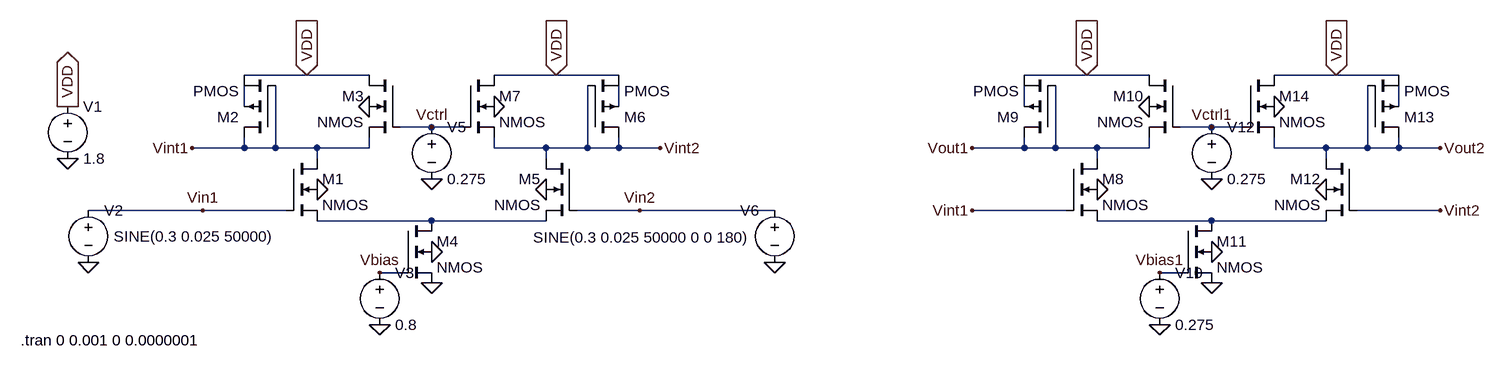
[diagram p0: schematic Cascaded_Differential_VGA.asc]
Cascaded_Differential_VGA.asc, the LTspice schematic file:
Version 4
SHEET 1 1636 680
WIRE -320 -96 -416 -96
WIRE -224 -96 -320 -96
WIRE 64 -96 -32 -96
WIRE 160 -96 64 -96
WIRE 880 -96 784 -96
WIRE 976 -96 880 -96
WIRE 1264 -96 1168 -96
WIRE 1360 -96 1264 -96
WIRE -416 -48 -416 -80
WIRE 160 -48 160 -80
WIRE 784 -48 784 -80
WIRE 1360 -48 1360 -80
WIRE -128 -16 -176 -16
WIRE -80 -16 -128 -16
WIRE 1072 -16 1024 -16
WIRE 1120 -16 1072 -16
WIRE -416 16 -416 0
WIRE -416 16 -496 16
WIRE -368 16 -368 -80
WIRE -368 16 -416 16
WIRE -304 16 -368 16
WIRE -224 16 -224 0
WIRE -224 16 -304 16
WIRE -32 16 -32 0
WIRE 48 16 -32 16
WIRE 112 16 112 -80
WIRE 112 16 48 16
WIRE 160 16 160 0
WIRE 160 16 112 16
WIRE 224 16 160 16
WIRE 784 16 784 0
WIRE 784 16 704 16
WIRE 832 16 832 -80
WIRE 832 16 784 16
WIRE 896 16 832 16
WIRE 976 16 976 0
WIRE 976 16 896 16
WIRE 1168 16 1168 0
WIRE 1248 16 1168 16
WIRE 1312 16 1312 -80
WIRE 1312 16 1248 16
WIRE 1360 16 1360 0
WIRE 1360 16 1312 16
WIRE 1424 16 1360 16
WIRE -304 32 -304 16
WIRE 48 32 48 16
WIRE 896 32 896 16
WIRE 1248 32 1248 16
WIRE -480 112 -656 112
WIRE -352 112 -480 112
WIRE 192 112 96 112
WIRE 400 112 192 112
WIRE 848 112 704 112
WIRE 1424 112 1296 112
WIRE -128 128 -304 128
WIRE 48 128 -128 128
WIRE 1072 128 896 128
WIRE 1248 128 1072 128
WIRE -176 208 -208 208
WIRE 1024 208 992 208
FLAG -224 -48 0
FLAG -304 80 0
FLAG -128 176 0
FLAG -320 -96 VDD
IOPIN -320 -96 In
FLAG -688 -48 VDD
IOPIN -688 -48 Out
FLAG -128 224 0
FLAG -208 288 0
FLAG -688 32 0
FLAG -128 64 0
FLAG -32 -48 0
FLAG 48 80 0
FLAG 64 -96 VDD
IOPIN 64 -96 In
FLAG -480 112 Vin1
FLAG 192 112 Vin2
FLAG -496 16 Vint1
FLAG 224 16 Vint2
FLAG -128 -16 Vctrl
FLAG -208 208 Vbias
FLAG 976 -48 0
FLAG 896 80 0
FLAG 1072 176 0
FLAG 880 -96 VDD
IOPIN 880 -96 In
FLAG 1072 224 0
FLAG 992 288 0
FLAG 1072 64 0
FLAG 1168 -48 0
FLAG 1248 80 0
FLAG 1264 -96 VDD
IOPIN 1264 -96 In
FLAG 704 16 Vout1
FLAG 1424 16 Vout2
FLAG 1072 -16 Vctrl1
FLAG 992 208 Vbias1
FLAG -656 192 0
FLAG 400 192 0
FLAG 704 112 Vint1
FLAG 1424 112 Vint2
SYMBOL nmos4 -352 32 R0
SYMATTR InstName M1
SYMATTR Value2 l=100nm w=120nm
SYMBOL pmos4 -368 0 R180
SYMATTR InstName M2
SYMATTR Value2 l=1um w=180nm
SYMBOL nmos4 -176 -96 M0
SYMATTR InstName M3
SYMATTR Value2 l=100nm w=120nm
SYMBOL nmos4 -176 128 R0
SYMATTR InstName M4
SYMATTR Value2 l=100nm w=120nm
SYMBOL voltage -688 -64 R0
WINDOW 123 0 0 Left 0
WINDOW 39 0 0 Left 0
SYMATTR InstName V1
SYMATTR Value 1.8
SYMBOL voltage -656 96 R0
WINDOW 3 39 56 Left 2
WINDOW 123 0 0 Left 0
WINDOW 39 0 0 Left 0
SYMATTR Value SINE(0.3 0.025 50000)
SYMATTR InstName V2
SYMBOL voltage -208 192 R0
WINDOW 123 0 0 Left 0
WINDOW 39 0 0 Left 0
SYMATTR InstName V3
SYMATTR Value 0.8
SYMBOL voltage -128 -32 R0
WINDOW 123 0 0 Left 0
WINDOW 39 0 0 Left 0
SYMATTR InstName V5
SYMATTR Value 0.275
SYMBOL nmos4 96 32 M0
SYMATTR InstName M5
SYMATTR Value2 l=100nm w=120nm
SYMBOL pmos4 112 0 M180
SYMATTR InstName M6
SYMATTR Value2 l=1um w=180nm
SYMBOL nmos4 -80 -96 R0
SYMATTR InstName M7
SYMATTR Value2 l=100nm w=120nm
SYMBOL voltage 400 96 M0
WINDOW 3 36 58 Left 2
WINDOW 123 0 0 Left 0
WINDOW 39 0 0 Left 0
SYMATTR Value SINE(0.3 0.025 50000 0 0 180)
SYMATTR InstName V6
SYMBOL nmos4 848 32 R0
SYMATTR InstName M8
SYMATTR Value2 l=100nm w=120nm
SYMBOL pmos4 832 0 R180
SYMATTR InstName M9
SYMATTR Value2 l=1um w=180nm
SYMBOL nmos4 1024 -96 M0
SYMATTR InstName M10
SYMATTR Value2 l=100nm w=120nm
SYMBOL nmos4 1024 128 R0
SYMATTR InstName M11
SYMATTR Value2 l=100nm w=120nm
SYMBOL voltage 992 192 R0
WINDOW 123 0 0 Left 0
WINDOW 39 0 0 Left 0
SYMATTR InstName V10
SYMATTR Value 0.275
SYMBOL voltage 1072 -32 R0
WINDOW 123 0 0 Left 0
WINDOW 39 0 0 Left 0
SYMATTR InstName V12
SYMATTR Value 0.275
SYMBOL nmos4 1296 32 M0
SYMATTR InstName M12
SYMATTR Value2 l=100nm w=120nm
SYMBOL pmos4 1312 0 M180
SYMATTR InstName M13
SYMATTR Value2 l=1um w=180nm
SYMBOL nmos4 1120 -96 R0
SYMATTR InstName M14
SYMATTR Value2 l=100nm w=120nm
TEXT -760 312 Left 2 !.tran 0 0.001 0 0.0000001

The netlist it stands for:
* Cascaded_Differential_VGA.asc
M1 Vint1 Vin1 N005 0 NMOS l=100nm w=120nm
M2 Vint1 Vint1 VDD N001 PMOS l=1um w=180nm
M3 VDD Vctrl Vint1 0 NMOS l=100nm w=120nm
M4 N005 Vbias 0 0 NMOS l=100nm w=120nm
V1 VDD 0 1.8
V2 Vin1 0 SINE(0.3 0.025 50000)
V3 Vbias 0 0.8
V5 Vctrl 0 0.275
M5 Vint2 Vin2 N005 0 NMOS l=100nm w=120nm
M6 Vint2 Vint2 VDD N002 PMOS l=1um w=180nm
M7 VDD Vctrl Vint2 0 NMOS l=100nm w=120nm
V6 Vin2 0 SINE(0.3 0.025 50000 0 0 180)
M8 Vout1 Vint1 N006 0 NMOS l=100nm w=120nm
M9 Vout1 Vout1 VDD N003 PMOS l=1um w=180nm
M10 VDD Vctrl1 Vout1 0 NMOS l=100nm w=120nm
M11 N006 Vbias1 0 0 NMOS l=100nm w=120nm
V10 Vbias1 0 0.275
V12 Vctrl1 0 0.275
M12 Vout2 Vint2 N006 0 NMOS l=100nm w=120nm
M13 Vout2 Vout2 VDD N004 PMOS l=1um w=180nm
M14 VDD Vctrl1 Vout2 0 NMOS l=100nm w=120nm
.model NMOS NMOS
.model PMOS PMOS
.lib standard.mos
.tran 0 0.001 0 0.0000001
.backanno
.end